# EAGLE schematic Gibbot v4 (EAGLE 5.12)

## Sheet 1 of 7
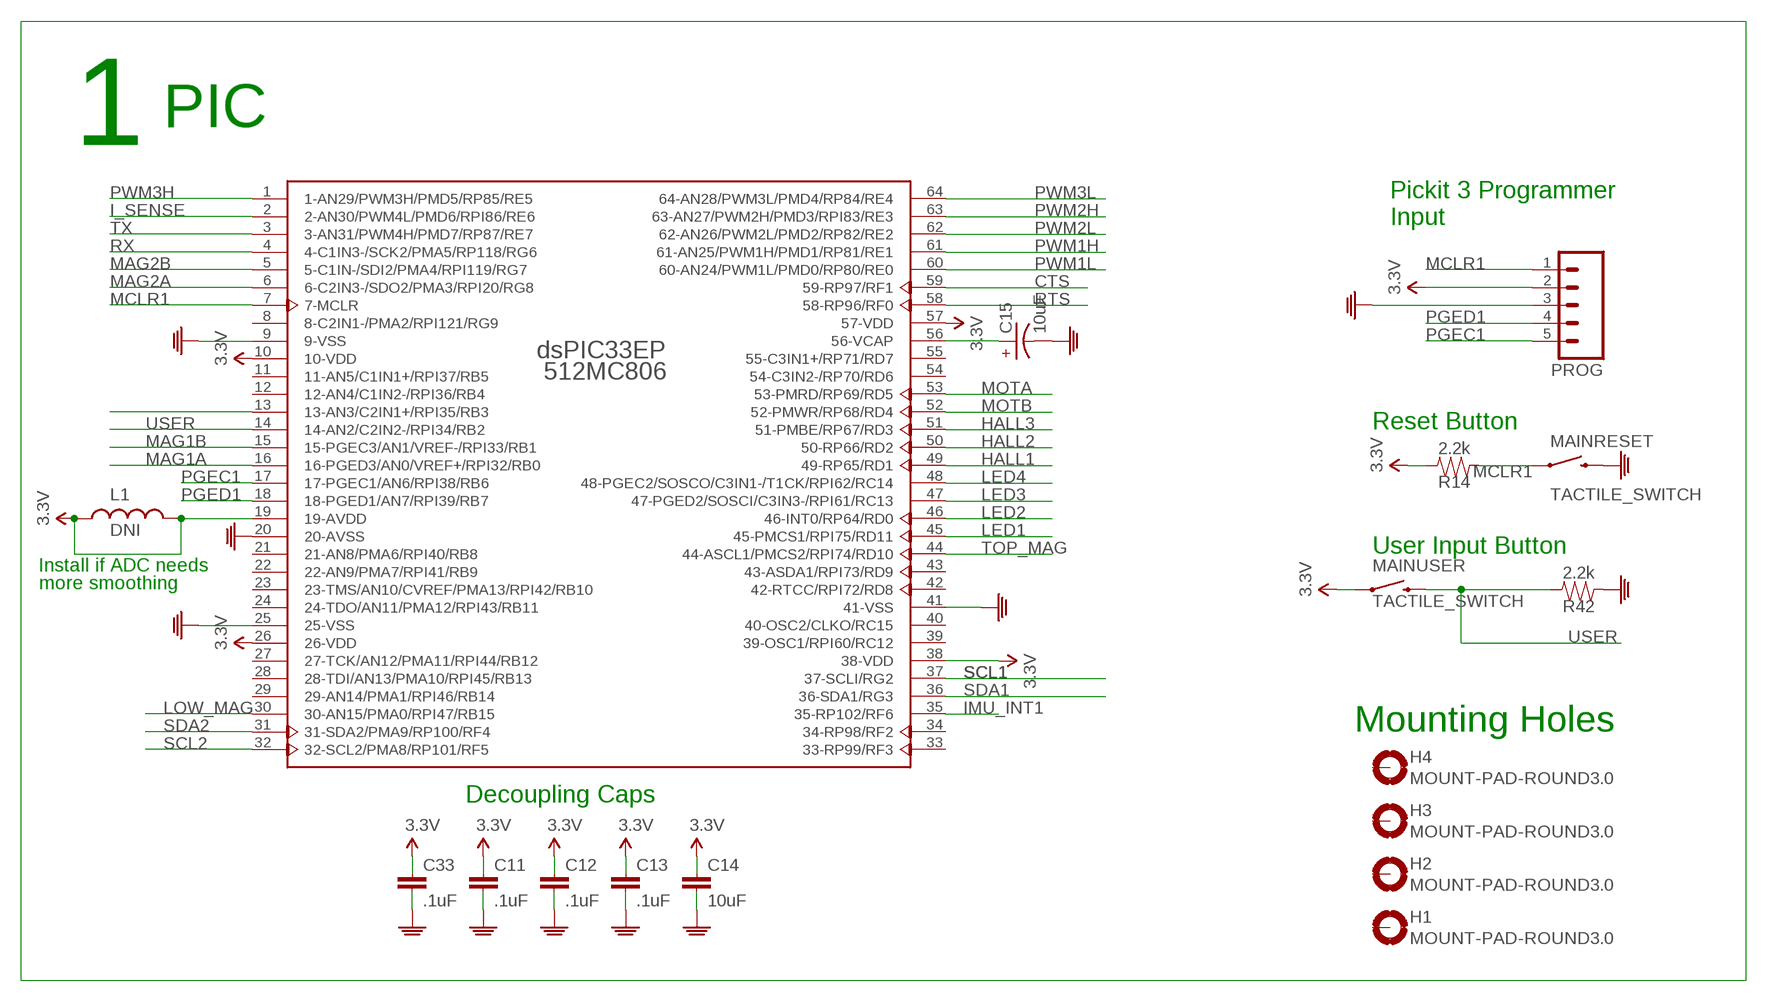
[diagram p0: schematic, sheet 1]

### Parts
C11  .1uF  CAP1206  [1206]
C12  .1uF  CAP1206  [1206]
C13  .1uF  CAP1206  [1206]
C14  10uF  CAP1206  [1206]
C15  10uF  CAP-POLEEH  [EEH-ZA1H101P]
C33  .1uF  CAP1206  [1206]
H1  MOUNT-PAD-ROUND3.0  [3,0-PAD]
H2  MOUNT-PAD-ROUND3.0  [3,0-PAD]
H3  MOUNT-PAD-ROUND3.0  [3,0-PAD]
H4  MOUNT-PAD-ROUND3.0  [3,0-PAD]
L1  DNI  INDUCTOR0603  [0603]
MAINRESET  TACTILE_SWITCH  [TACTILE_SWITCH]
MAINUSER  TACTILE_SWITCH  [TACTILE_SWITCH]
PROG  M05JST-SH  [JST-SH-5]
R14  2.2k  R0603  [0603]
R42  2.2k  R0603  [0603]
U$1  DSPIC33EP512MC806  [TQFP64_10X10]

### Nets
3.3V: C11.1 C12.1 C13.1 C14.1 C33.1 L1.1 L1.2 MAINUSER.1 PROG.2 R14.2 U$1.10(10-VDD) U$1.19(19-AVDD) U$1.26(26-VDD) U$1.38(38-VDD) U$1.57(57-VDD) ; also sheet 2,3,4,6,7
CTS: U$1.59(59-RP97/RF1) ; also sheet 3
GND: C11.2 C12.2 C13.2 C14.2 C15.- C33.2 MAINRESET.2 PROG.3 R42.1 U$1.9(9-VSS) U$1.20(20-AVSS) U$1.25(25-VSS) U$1.41(41-VSS) ; also sheet 2,3,4,5,6,7
HALL1: U$1.49(49-RP65/RD1) ; also sheet 3
HALL2: U$1.50(50-RP66/RD2) ; also sheet 3
HALL3: U$1.51(51-PMBE/RP67/RD3) ; also sheet 3
I_SENSE: U$1.2(2-AN30/PWM4L/PMD6/RPI86/RE6) ; also sheet 2
IMU_INT1: U$1.35(35-RP102/RF6) ; also sheet 3
LED1: U$1.45(45-PMCS1/RPI75/RD11) ; also sheet 3
LED2: U$1.46(46-INT0/RP64/RD0) ; also sheet 3
LED3: U$1.47(47-PGED2/SOSCI/C3IN3-/RPI61/RC13) ; also sheet 3
LED4: U$1.48(48-PGEC2/SOSCO/C3IN1-/T1CK/RPI62/RC14) ; also sheet 3
LOW_MAG: U$1.30(30-AN15/PMA0/RPI47/RB15)
MAG1A: U$1.16(16-PGED3/AN0/VREF+/RPI32/RB0) ; also sheet 3
MAG1B: U$1.15(15-PGEC3/AN1/VREF-/RPI33/RB1) ; also sheet 3
MAG2A: U$1.6(6-C2IN3-/SDO2/PMA3/RPI20/RG8)
MAG2B: U$1.5(5-C1IN-/SDI2/PMA4/RPI119/RG7)
MCLR1: MAINRESET.1 PROG.1 R14.1 U$1.7(7-MCLR)
MOTA: U$1.53(53-PMRD/RP69/RD5)
MOTB: U$1.52(52-PMWR/RP68/RD4)
N$16: C15.+ U$1.56(56-VCAP)
N$34: U$1.13(13-AN3/C2IN1+/RPI35/RB3)
PGEC1: PROG.5 U$1.17(17-PGEC1/AN6/RPI38/RB6)
PGED1: PROG.4 U$1.18(18-PGED1/AN7/RPI39/RB7)
PWM1H: U$1.61(61-AN25/PWM1H/PMD1/RP81/RE1) ; also sheet 2
PWM1L: U$1.60(60-AN24/PWM1L/PMD0/RP80/RE0) ; also sheet 2
PWM2H: U$1.63(63-AN27/PWM2H/PMD3/RPI83/RE3) ; also sheet 2
PWM2L: U$1.62(62-AN26/PWM2L/PMD2/RP82/RE2) ; also sheet 2
PWM3H: U$1.1(1-AN29/PWM3H/PMD5/RP85/RE5) ; also sheet 2
PWM3L: U$1.64(64-AN28/PWM3L/PMD4/RP84/RE4) ; also sheet 2
RTS: U$1.58(58-RP96/RF0) ; also sheet 3
RX: U$1.4(4-C1IN3-/SCK2/PMA5/RP118/RG6) ; also sheet 3
SCL1: U$1.37(37-SCLI/RG2) ; also sheet 3
SCL2: U$1.32(32-SCL2/PMA8/RP101/RF5) ; also sheet 3
SDA1: U$1.36(36-SDA1/RG3) ; also sheet 3
SDA2: U$1.31(31-SDA2/PMA9/RP100/RF4) ; also sheet 3
TOP_MAG: U$1.44(44-ASCL1/PMCS2/RPI74/RD10) ; also sheet 3
TX: U$1.3(3-AN31/PWM4H/PMD7/RP87/RE7) ; also sheet 3
USER: MAINUSER.2 R42.2 U$1.14(14-AN2/C2IN2-/RPI34/RB2)
Unconnected: H1.B3,0(MOUNT) H2.B3,0(MOUNT) H3.B3,0(MOUNT) H4.B3,0(MOUNT) U$1.8(8-C2IN1-/PMA2/RPI121/RG9) U$1.11(11-AN5/C1IN1+/RPI37/RB5) U$1.12(12-AN4/C1IN2-/RPI36/RB4) U$1.21(21-AN8/PMA6/RPI40/RB8) U$1.22(22-AN9/PMA7/RPI41/RB9) U$1.23(23-TMS/AN10/CVREF/PMA13/RPI42/RB10) U$1.24(24-TDO/AN11/PMA12/RPI43/RB11) U$1.27(27-TCK/AN12/PMA11/RPI44/RB12) U$1.28(28-TDI/AN13/PMA10/RPI45/RB13) U$1.29(29-AN14/PMA1/RPI46/RB14) U$1.33(33-RP99/RF3) U$1.34(34-RP98/RF2) U$1.39(39-OSC1/RPI60/RC12) U$1.40(40-OSC2/CLKO/RC15) U$1.42(42-RTCC/RPI72/RD8) U$1.43(43-ASDA1/RPI73/RD9) U$1.54(54-C3IN2-/RP70/RD6) U$1.55(55-C3IN1+/RP71/RD7)

### Notes on the sheet
- PIC
- 1
- Pickit 3 Programmer
- Input
- Reset Button
- User Input Button
- Install if ADC needs
- more smoothing
- Mounting Holes
- Decoupling Caps

## Sheet 2 of 7
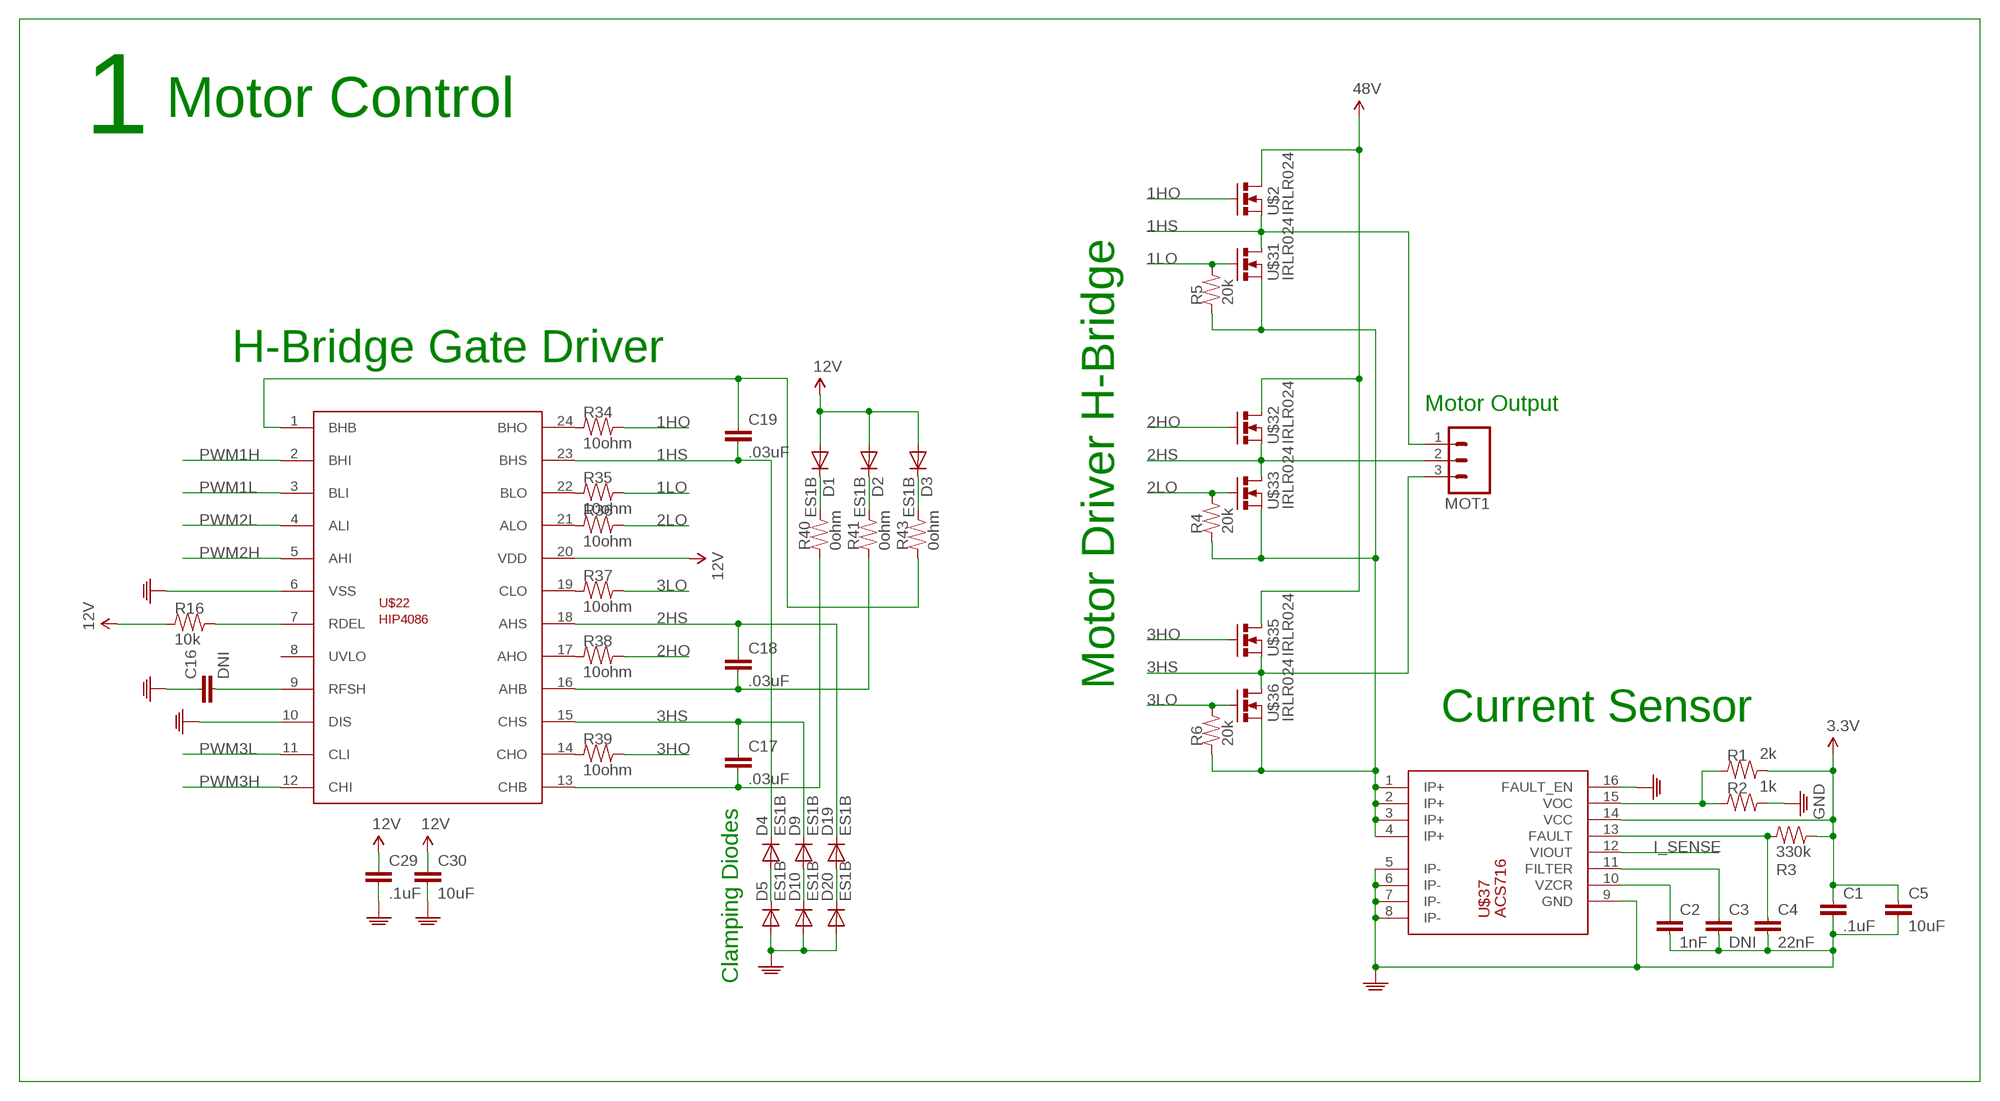
[diagram p1: schematic, sheet 2]

### Parts
C1  .1uF  CAP0603  [0603]
C2  1nF  CAP0603  [0603]
C3  DNI  CAP0603  [0603]
C4  22nF  CAP0603  [0603]
C5  10uF  CAP0603  [0603]
C16  DNI  CAP0603  [0603]
C17  .03uF  CAP0603  [0603]
C18  .03uF  CAP0603  [0603]
C19  .03uF  CAP0603  [0603]
C29  .1uF  CAP0603  [0603]
C30  10uF  CAP0603  [0603]
D1  ES1B  DIODESMA  [SMA-DIODE@1]
D2  ES1B  DIODESMA  [SMA-DIODE@1]
D3  ES1B  DIODESMA  [SMA-DIODE@1]
D4  ES1B  DIODESMA  [SMA-DIODE@1]
D5  ES1B  DIODESMA  [SMA-DIODE@1]
D9  ES1B  DIODESMA  [SMA-DIODE@1]
D10  ES1B  DIODESMA  [SMA-DIODE@1]
D19  ES1B  DIODESMA  [SMA-DIODE@1]
D20  ES1B  DIODESMA  [SMA-DIODE@1]
MOT1  M03MOLEX-MINI-FIT-JR  [39-30-3036]
R1  2k  R0603  [0603]
R2  1k  R0603  [0603]
R3  330k  R0603  [0603]
R4  20k  R0603  [0603]
R5  20k  R0603  [0603]
R6  20k  R0603  [0603]
R16  10k  R0603  [0603]
R34  10ohm  R0603  [0603]
R35  10ohm  R0603  [0603]
R36  10ohm  R0603  [0603]
R37  10ohm  R0603  [0603]
R38  10ohm  R0603  [0603]
R39  10ohm  R0603  [0603]
R40  0ohm  R0603  [0603]
R41  0ohm  R0603  [0603]
R43  0ohm  R0603  [0603]
U$2  IRLR024  N-MOSDPAK  [DPAK]
U$22  HIP4086  [SOIC24-W]
U$31  IRLR024  N-MOSDPAK  [DPAK]
U$32  IRLR024  N-MOSDPAK  [DPAK]
U$33  IRLR024  N-MOSDPAK  [DPAK]
U$35  IRLR024  N-MOSDPAK  [DPAK]
U$36  IRLR024  N-MOSDPAK  [DPAK]
U$37  ACS716  [SOIC16-W]

### Nets
1HO: R34.2 U$2.G
1HS: C19.2 D4.C MOT1.1 U$2.S U$22.23(BHS) U$31.D
1LO: R5.2 R35.2 U$31.G
2HO: R38.2 U$32.G
2HS: C18.1 D19.C MOT1.2 U$22.18(AHS) U$32.S U$33.D
2LO: R4.2 R36.2 U$33.G
3.3V: C1.1 C5.1 R1.2 R3.2 U$37.14(VCC) ; also sheet 1,3,4,6,7
3HO: R39.2 U$35.G
3HS: C17.1 D9.C MOT1.3 U$22.15(CHS) U$35.S U$36.D
3LO: R6.2 R37.2 U$36.G
12V: C29.1 C30.1 D1.A D2.A D3.A R16.1 U$22.20(VDD) ; also sheet 3,4
48V: U$2.D U$32.D U$35.D ; also sheet 4
GND: C1.2 C2.2 C3.2 C4.2 C5.2 C16.1 C29.2 C30.2 D5.A D10.A D20.A R2.2 U$22.6(VSS) U$22.10(DIS) U$37.5(IP-) U$37.6(IP-) U$37.7(IP-) U$37.8(IP-) U$37.9(GND) U$37.16(FAULT_EN) ; also sheet 1,3,4,5,6,7
I_SENSE: U$37.12(VIOUT) ; also sheet 1
N$2: R16.2 U$22.7(RDEL)
N$3: C16.2 U$22.9(RFSH)
N$4: R4.1 R5.1 R6.1 U$31.S U$33.S U$36.S U$37.1(IP+) U$37.2(IP+) U$37.3(IP+) U$37.4(IP+)
N$5: R1.1 R2.1 U$37.15(VOC)
N$6: C4.1 R3.1 U$37.13(FAULT)
N$7: C2.1 U$37.10(VZCR)
N$8: C3.1 U$37.11(FILTER)
N$26: R34.1 U$22.24(BHO)
N$35: R35.1 U$22.22(BLO)
N$36: R36.1 U$22.21(ALO)
N$37: R37.1 U$22.19(CLO)
N$38: R38.1 U$22.17(AHO)
N$48: R39.1 U$22.14(CHO)
N$50: C17.2 R40.1 U$22.13(CHB)
N$52: C18.2 R41.1 U$22.16(AHB)
N$54: C19.1 R43.1 U$22.1(BHB)
N$55: D3.C R43.2
N$58: D2.C R41.2
N$59: D1.C R40.2
N$60: D4.A D5.C
N$61: D9.A D10.C
N$62: D19.A D20.C
PWM1H: U$22.2(BHI) ; also sheet 1
PWM1L: U$22.3(BLI) ; also sheet 1
PWM2H: U$22.5(AHI) ; also sheet 1
PWM2L: U$22.4(ALI) ; also sheet 1
PWM3H: U$22.12(CHI) ; also sheet 1
PWM3L: U$22.11(CLI) ; also sheet 1
Unconnected: U$22.8(UVLO)

### Notes on the sheet
- Motor Control
- 1
- H-Bridge Gate Driver
- Motor Output
- Motor Driver H-Bridge
- Current Sensor
- Clamping Diodes

## Sheet 3 of 7
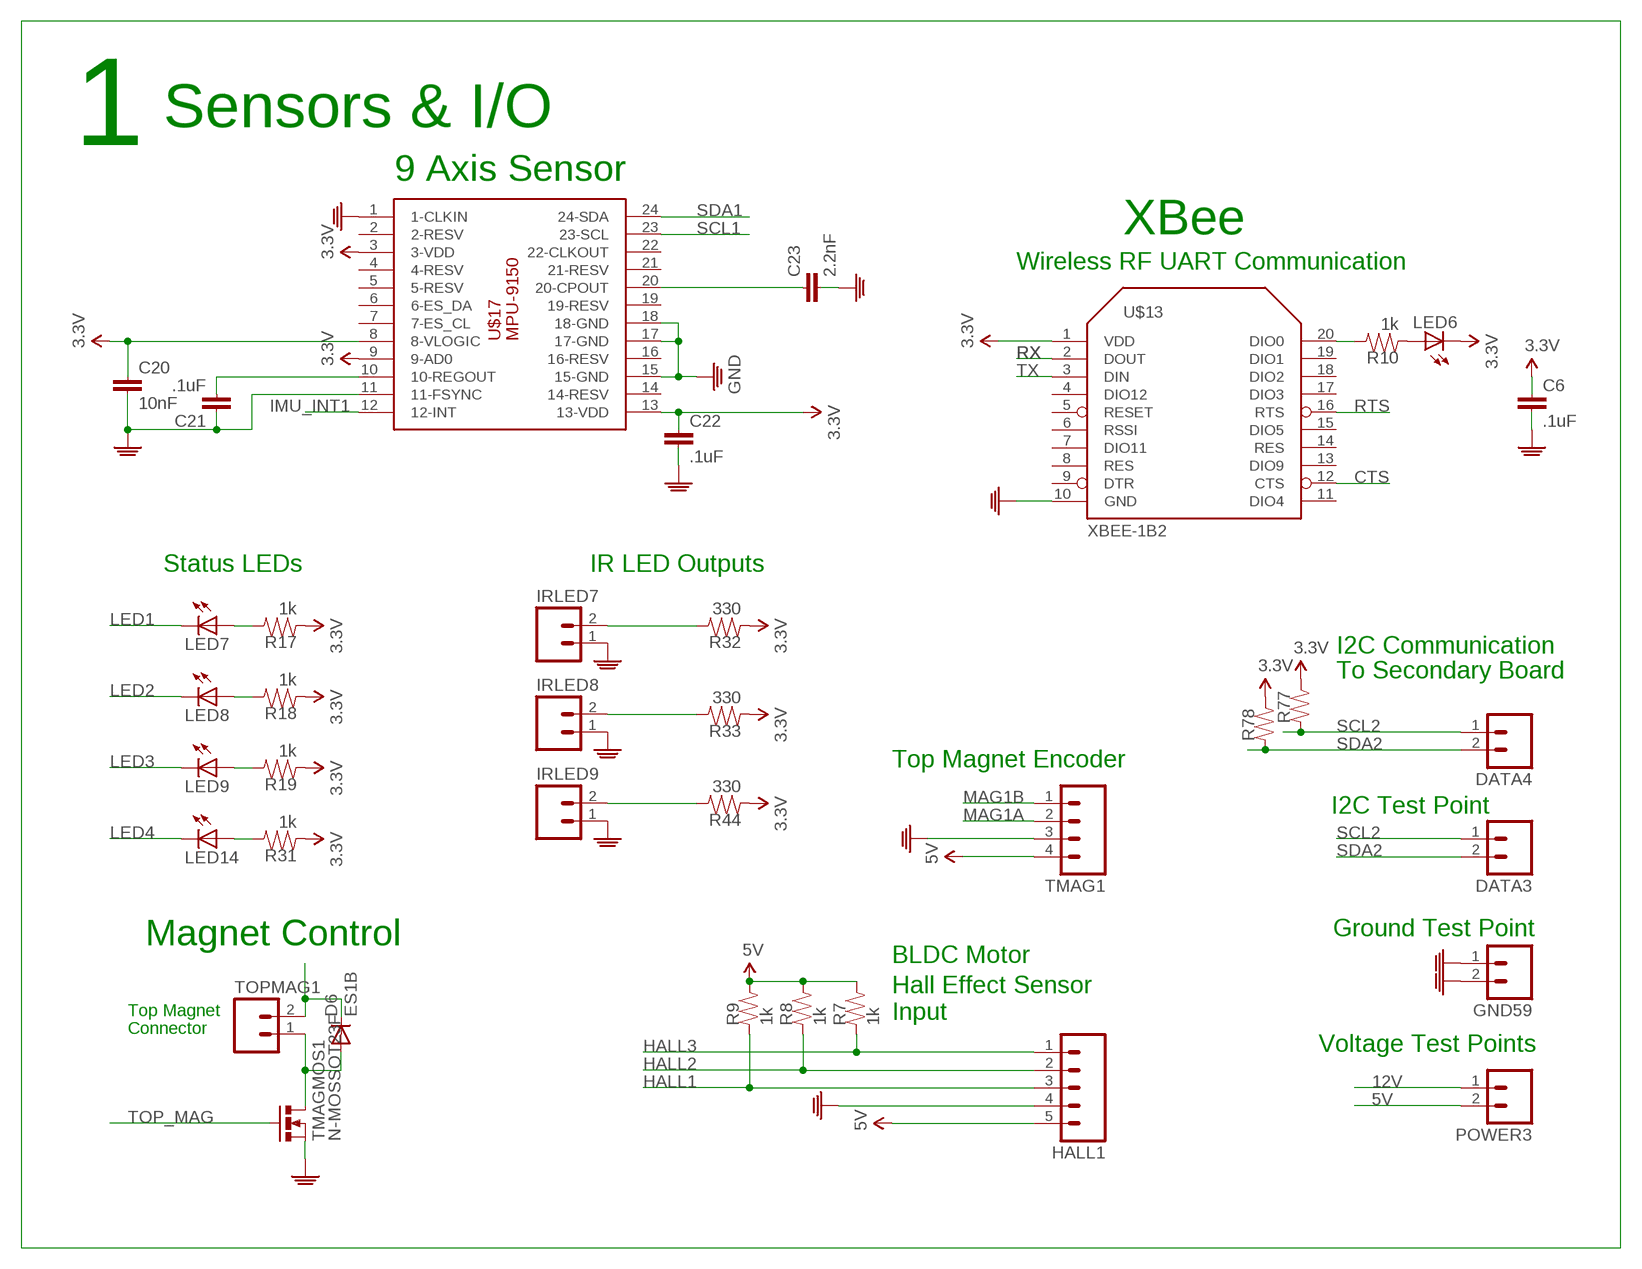
[diagram p2: schematic, sheet 3]

### Parts
C6  .1uF  CAP0603  [0603]
C20  10nF  CAP0603  [0603]
C21  .1uF  CAP0603  [0603]
C22  .1uF  CAP0603  [0603]
C23  2.2nF  CAP0603  [0603]
D6  ES1B  DIODESMA  [SMA-DIODE@1]
DATA3  M02JST-SH  [JST-SH-2]
DATA4  M02JST-SH  [JST-SH-2]
GND59  M02JST-SH  [JST-SH-2]
HALL1  M05JST-SH  [JST-SH-5]
IRLED7  M02JST-SH  [JST-SH-2]
IRLED8  M02JST-SH  [JST-SH-2]
IRLED9  M02JST-SH  [JST-SH-2]
LED6  LED0603  [0603-DIODE]
LED7  LED0603  [0603-DIODE]
LED8  LED0603  [0603-DIODE]
LED9  LED0603  [0603-DIODE]
LED14  LED0603  [0603-DIODE]
POWER3  M02JST-SH  [JST-SH-2]
R7  1k  R0603  [0603]
R8  1k  R0603  [0603]
R9  1k  R0603  [0603]
R10  1k  R0603  [0603]
R17  1k  R0603  [0603]
R18  1k  R0603  [0603]
R19  1k  R0603  [0603]
R31  1k  R0603  [0603]
R32  330  R0603  [0603]
R33  330  R0603  [0603]
R44  330  R0603  [0603]
R77  R0603  [0603]
R78  R0603  [0603]
TMAG1  M04JST-SH  [JST-SH-4]
TMAGMOS1  N-MOSSOT23F  [SOT23F]
TOPMAG1  M02JST-SH  [JST-SH-2]
U$13  XBEE-1B2  [XBEE-SILK]
U$17  MPU-9150  [LGA24_4X4]

### Nets
3.3V: C6.1 C20.1 C22.1 LED6.CAT(C) R17.1 R18.1 R19.1 R31.1 R32.1 R33.1 R44.1 R77.2 R78.2 U$13.1(VDD) U$17.3(3-VDD) U$17.8(8-VLOGIC) U$17.9(9-AD0) U$17.13(13-VDD) ; also sheet 1,2,4,6,7
5V: HALL1.5 POWER3.2 R7.2 R8.2 R9.2 TMAG1.4 ; also sheet 4,7
12V: POWER3.1 ; also sheet 2,4
CTS: U$13.12(CTS) ; also sheet 1
GND: C6.2 C20.2 C21.1 C22.2 C23.2 GND59.1 GND59.2 HALL1.4 IRLED7.1 IRLED8.1 IRLED9.1 TMAG1.3 TMAGMOS1.S U$13.10(GND) U$17.1(1-CLKIN) U$17.11(11-FSYNC) U$17.15(15-GND) U$17.17(17-GND) U$17.18(18-GND) ; also sheet 1,2,4,5,6,7
HALL1: HALL1.3 R9.1 ; also sheet 1
HALL2: HALL1.2 R8.1 ; also sheet 1
HALL3: HALL1.1 R7.1 ; also sheet 1
IMU_INT1: U$17.12(12-INT) ; also sheet 1
LED1: LED7.CAT(C) ; also sheet 1
LED2: LED8.CAT(C) ; also sheet 1
LED3: LED9.CAT(C) ; also sheet 1
LED4: LED14.CAT(C) ; also sheet 1
MAG1A: TMAG1.2 ; also sheet 1
MAG1B: TMAG1.1 ; also sheet 1
N$9: R10.2 U$13.20(DIO0)
N$10: LED6.AN(A) R10.1
N$11: LED7.AN(A) R17.2
N$12: LED8.AN(A) R18.2
N$13: LED9.AN(A) R19.2
N$17: LED14.AN(A) R31.2
N$18: IRLED7.2 R32.2
N$19: IRLED8.2 R33.2
N$20: IRLED9.2 R44.2
N$23: D6.C TOPMAG1.2
N$24: C21.2 U$17.10(10-REGOUT)
N$25: C23.1 U$17.20(20-CPOUT)
N$27: D6.A TMAGMOS1.D TOPMAG1.1
RTS: U$13.16(RTS) ; also sheet 1
RX: U$13.2(DOUT) ; also sheet 1
SCL1: U$17.23(23-SCL) ; also sheet 1
SCL2: DATA3.1 DATA4.1 R77.1 ; also sheet 1
SDA1: U$17.24(24-SDA) ; also sheet 1
SDA2: DATA3.2 DATA4.2 R78.1 ; also sheet 1
TOP_MAG: TMAGMOS1.G ; also sheet 1
TX: U$13.3(DIN) ; also sheet 1
Unconnected: U$13.4(DIO12) U$13.5(RESET) U$13.6(RSSI) U$13.7(DIO11) U$13.8(RES) U$13.9(DTR) U$13.11(DIO4) U$13.13(DIO9) U$13.14(RES) U$13.15(DIO5) U$13.17(DIO3) U$13.18(DIO2) U$13.19(DIO1) U$17.2(2-RESV) U$17.4(4-RESV) U$17.5(5-RESV) U$17.6(6-ES_DA) U$17.7(7-ES_CL) U$17.14(14-RESV) U$17.16(16-RESV) U$17.19(19-RESV) U$17.21(21-RESV) U$17.22(22-CLKOUT)

### Notes on the sheet
- Sensors & I/O
- 1
- 9 Axis Sensor
- XBee
- Wireless RF UART Communication
- Status LEDs | IR LED Outputs
- I2C Communication
- To Secondary Board
- Top Magnet Encoder
- I2C Test Point
- Ground Test Point
- Magnet Control
- BLDC Motor
- Hall Effect Sensor
- Top Magnet | Input
- Connector
- Voltage Test Points

## Sheet 4 of 7
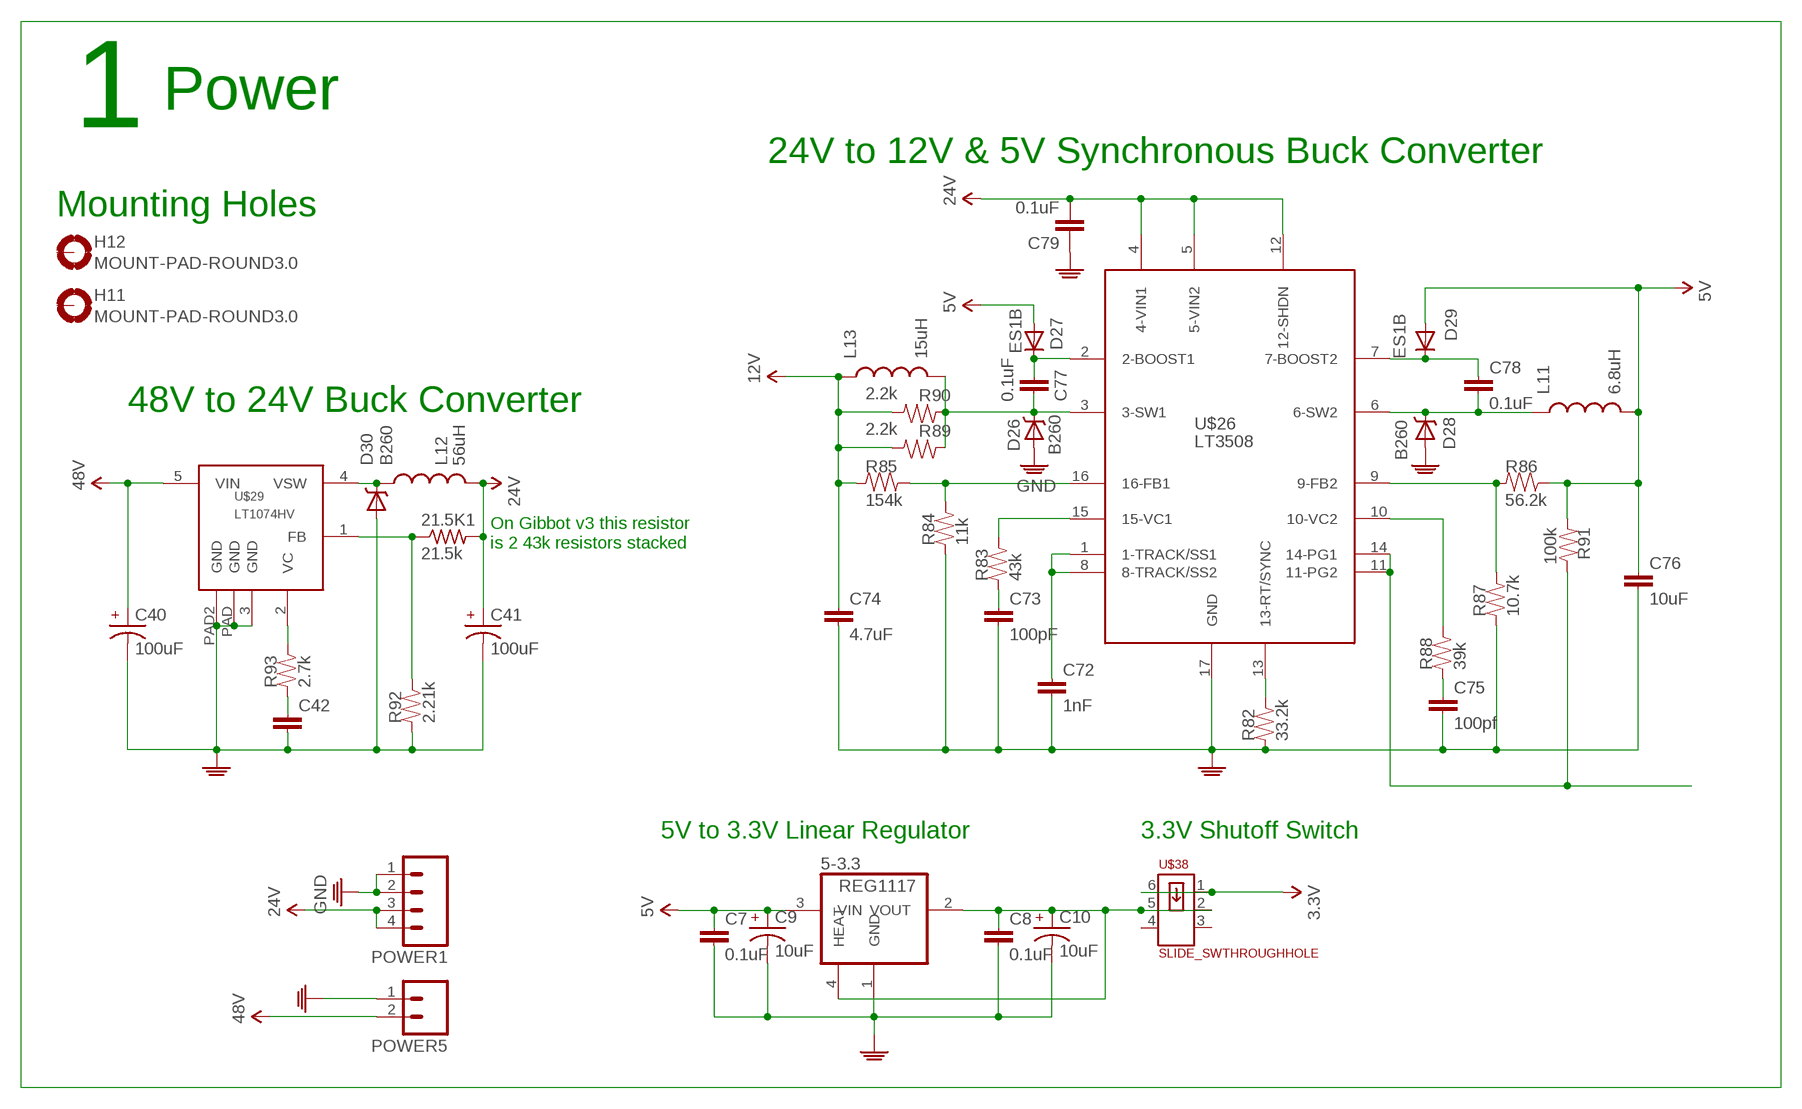
[diagram p3: schematic, sheet 4]

### Parts
5-3.3  REG1117  [SOT223]
21.5K1  21.5k  R-US_R0603  [R0603]
C7  0.1uF  CAP0603  [0603]
C8  0.1uF  CAP0603  [0603]
C9  10uF  CAP-POL0603  [0603-POL]
C10  10uF  CAP-POL0603  [0603-POL]
C40  100uF  CAP-POLEEH  [EEH-ZA1H101P]
C41  100uF  CAP-POLEEH  [EEH-ZA1H101P]
C42  CAP0603  [0603]
C72  1nF  CAP0603  [0603]
C73  100pF  CAP0603  [0603]
C74  4.7uF  CAP0603  [0603]
C75  100pf  CAP0603  [0603]
C76  10uF  CAP0603  [0603]
C77  0.1uF  CAP0603  [0603]
C78  0.1uF  CAP0603  [0603]
C79  0.1uF  CAP0603-CAP  [0603-CAP]
D26  B260  DIODE-SCHOTTKYSMB  [SMB-DIODE]
D27  ES1B  DIODESMA  [SMA-DIODE@1]
D28  B260  DIODE-SCHOTTKYSMB  [SMB-DIODE]
D29  ES1B  DIODESMA  [SMA-DIODE@1]
D30  B260  DIODE-SCHOTTKYSMB  [SMB-DIODE]
H11  MOUNT-PAD-ROUND3.0  [3,0-PAD]
H12  MOUNT-PAD-ROUND3.0  [3,0-PAD]
L11  6.8uH  INDUCTORSRN6045  [SRN6045]
L12  56uH  INDUCTOR2100LL-181  [2100LL-181]
L13  15uH  INDUCTOR2100LL-181  [2100LL-181]
POWER1  M04JST-SH  [JST-SH-4]
POWER5  M02JST-SH  [JST-SH-2]
R82  33.2k  R0603  [0603]
R83  43k  R0603  [0603]
R84  11k  R0603  [0603]
R85  154k  R0603  [0603]
R86  56.2k  R0603  [0603]
R87  10.7k  R0603  [0603]
R88  39k  R0603  [0603]
R89  2.2k  R0603  [0603]
R90  2.2k  R0603  [0603]
R91  100k  R0603  [0603]
R92  2.21k  R0603  [0603]
R93  2.7k  R0603  [0603]
U$26  LT3508  [TSSOP16]
U$29  LT1074HV  [TO220-5]
U$38  SLIDE_SWTHROUGHHOLE  [SLIDE_SWITCH]

### Nets
3.3V: U$38.1 U$38.6 ; also sheet 1,2,3,6,7
5V: 5-3.3.3(VIN) C7.1 C9.+ C76.1 D27.A D29.A L11.P$2 R86.2 R91.1 ; also sheet 3,7
12V: C74.1 L13.1 R85.1 R89.2 R90.2 ; also sheet 2,3
24V: 21.5K1.2 C41.+ C79.2 L12.2 POWER1.3 POWER1.4 U$26.4(4-VIN1) U$26.5(5-VIN2) U$26.12(12-SHDN) ; also sheet 7
48V: C40.+ POWER5.2 U$29.5(VIN) ; also sheet 2
GND: 5-3.3.1(GND) C7.2 C8.2 C9.- C10.- C40.- C41.- C42.2 C72.2 C73.2 C74.2 C75.2 C76.2 C79.1 D26.A D28.A D30.A POWER1.1 POWER1.2 POWER5.1 R82.1 R84.1 R87.1 R92.1 U$26.17(GND) U$29.3(GND) U$29.PAD2(GND) U$29.PAD(GND) ; also sheet 1,2,3,5,6,7
N$42: C42.1 R93.1
N$56: 5-3.3.2(VOUT) 5-3.3.4(HEAT) C8.1 C10.+ U$38.2 U$38.5
N$88: R84.2 R85.2 U$26.16(16-FB1)
N$119: R83.2 U$26.15(15-VC1)
N$129: R82.2 U$26.13(13-RT/SYNC)
N$130: C72.1 U$26.1(1-TRACK/SS1) U$26.8(8-TRACK/SS2)
N$131: C73.1 R83.1
N$134: R86.1 R87.2 U$26.9(9-FB2)
N$135: R91.2 U$26.11(11-PG2) U$26.14(14-PG1)
N$136: C75.1 R88.1
N$137: R88.2 U$26.10(10-VC2)
N$138: C77.2 D26.C L13.2 R89.1 R90.1 U$26.3(3-SW1)
N$139: C77.1 D27.C U$26.2(2-BOOST1)
N$140: C78.2 D28.C L11.P$1 U$26.6(6-SW2)
N$141: C78.1 D29.C U$26.7(7-BOOST2)
N$142: D30.C L12.1 U$29.4(VSW)
N$143: 21.5K1.1 R92.2 U$29.1(FB)
N$144: R93.2 U$29.2(VC)
Unconnected: H11.B3,0(MOUNT) H12.B3,0(MOUNT) U$38.3 U$38.4

### Notes on the sheet
- 1 | Power
- 24V to 12V & 5V Synchronous Buck Converter
- Mounting Holes
- 48V to 24V Buck Converter
- On Gibbot v3 this resistor
- is 2 43k resistors stacked
- 5V to 3.3V Linear Regulator | 3.3V Shutoff Switch

## Sheet 5 of 7
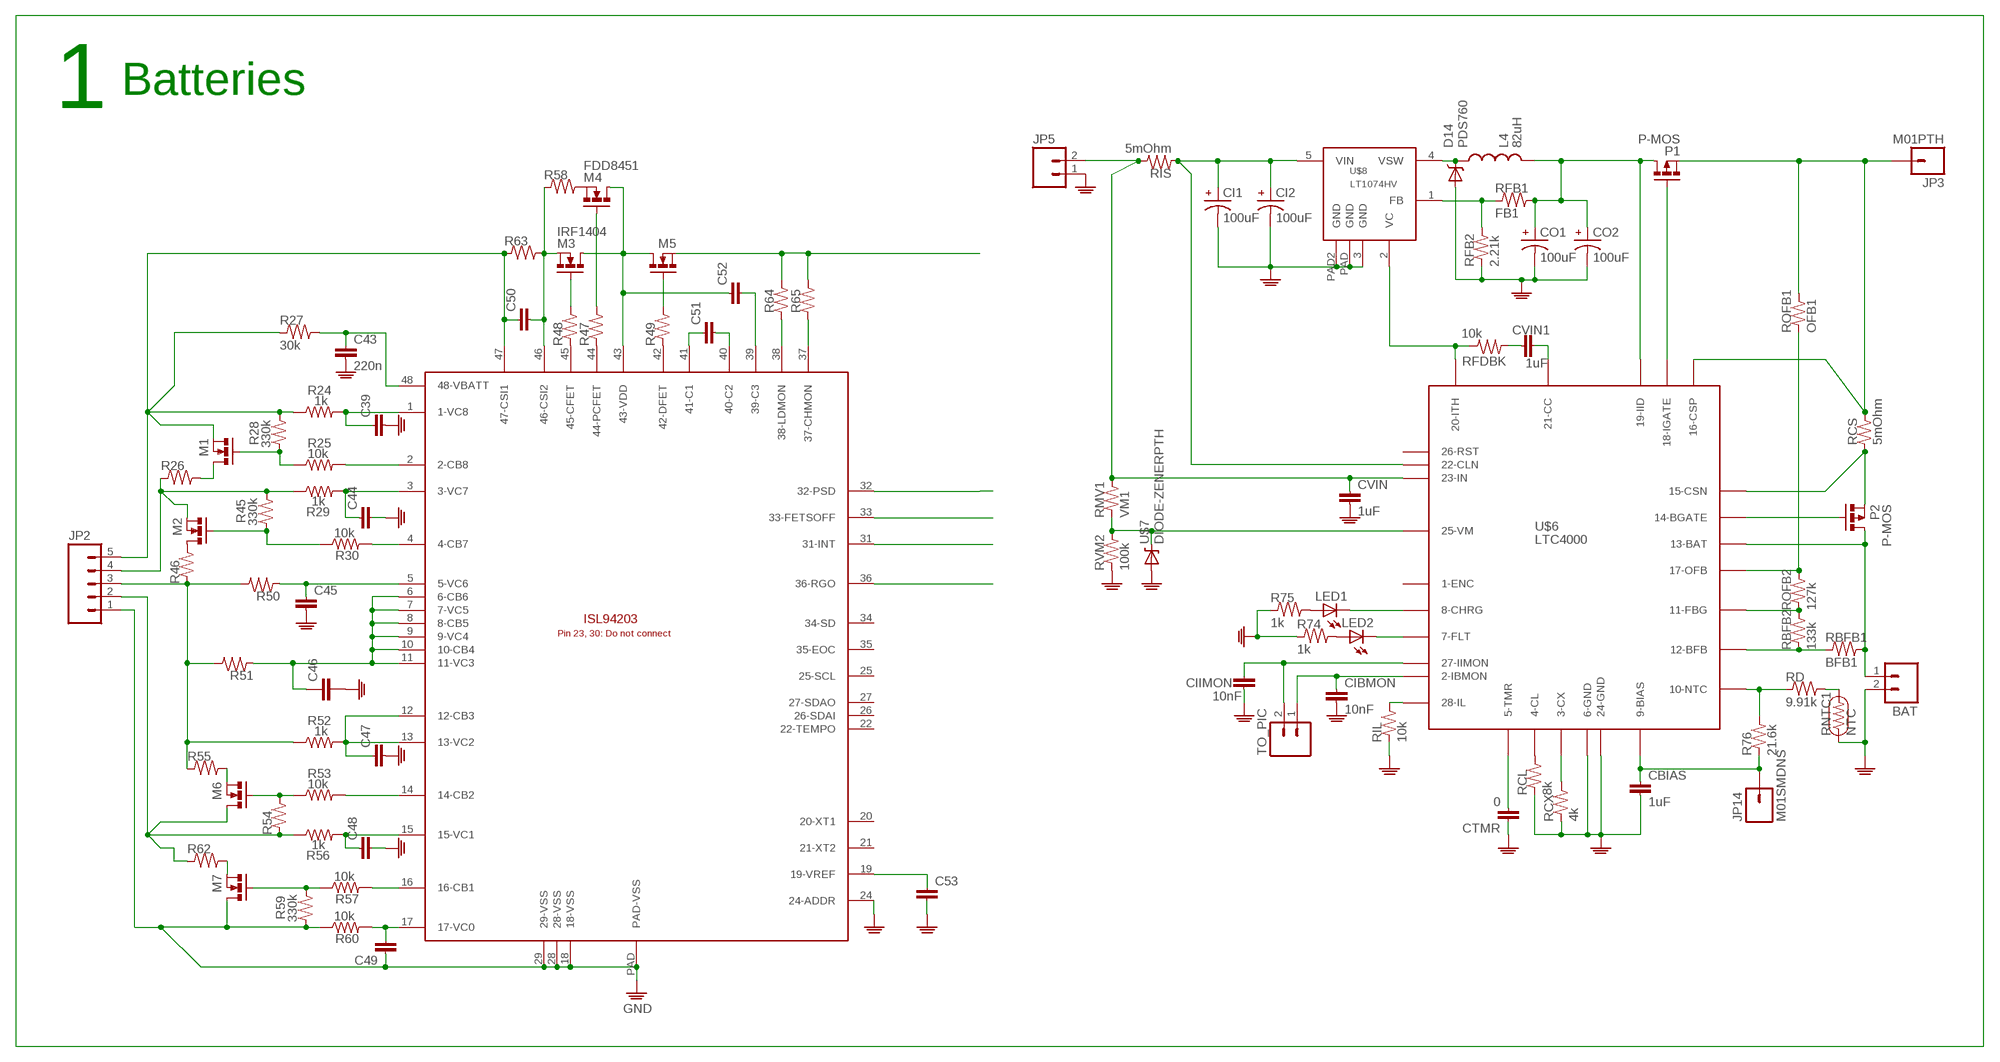
[diagram p4: schematic, sheet 5]

### Parts
BAT  M02LOCK  [1X02_LOCK]
C39  CAP0603  [0603]
C43  220n  CAP0603  [0603]
C44  CAP0603  [0603]
C45  CAP0603  [0603]
C46  CAP0603-CAP  [0603-CAP]
C47  CAP0603  [0603]
C48  CAP0603  [0603]
C49  CAP0603  [0603]
C50  CAP0603  [0603]
C51  CAP0603  [0603]
C52  CAP0603  [0603]
C53  CAP0603  [0603]
CBIAS  1uF  CAPPTH  [CAP-PTH-SMALL]
CI1  100uF  CAP-POLPCV10  [PCV10]
CI2  100uF  CAP-POLPCV10  [PCV10]
CIBMON  10nF  CAPPTH  [CAP-PTH-SMALL]
CIIMON  10nF  CAPPTH  [CAP-PTH-SMALL]
CO1  100uF  CAP-POLPCV10  [PCV10]
CO2  100uF  CAP-POLPCV10  [PCV10]
CTMR  0  CAPPTH  [CAP-PTH-SMALL]
CVIN  1uF  CAPPTH  [CAP-PTH-SMALL]
CVIN1  1uF  CAPPTH  [CAP-PTH-SMALL]
D14  PDS760  DIODE-SCHOTTKYPDS760  [POWERDI5]
JP2  M05PTH_LONGPADS  [1X05_LONGPADS]
JP3  M01PTH  [1X01]
JP5  M02MINI-FIT-JR  [WM8601]
JP14  M01SMDNS  [1X01NS]
L4  82uH  INDUCTOR2200LL-820  [2200LL-820]
LED1  LED0603  [0603-DIODE]
LED2  LED0603  [0603-DIODE]
M1  N-MOSSOT23F  [SOT23F]
M2  N-MOSSOT23F  [SOT23F]
M3  IRF1404  N-MOSD2PAK  [D2PAK@1]
M4  FDD8451  N-MOSDPAK  [DPAK]
M5  N-MOSD2PAK  [D2PAK@1]
M6  N-MOSSOT23F  [SOT23F]
M7  N-MOSSOT23F  [SOT23F]
P1  P-MOS  [D2PAK]
P2  P-MOS  [D2PAK]
R24  1k  R-US_R0603  [R0603]
R25  10k  R-US_R0603  [R0603]
R26  R-SHORT0603  [0603]
R27  30k  R-SHORT0603  [0603]
R28  330k  R-SHORT0603  [0603]
R29  1k  R-US_R0603  [R0603]
R30  10k  R-US_R0603  [R0603]
R45  330k  R-SHORT0603  [0603]
R46  R-SHORT0603  [0603]
R47  R-SHORT0603  [0603]
R48  R-SHORT0603  [0603]
R49  R-SHORT0603  [0603]
R50  R-SHORT0603  [0603]
R51  R-SHORT0603  [0603]
R52  1k  R-US_R0603  [R0603]
R53  10k  R-US_R0603  [R0603]
R54  R-SHORT0603  [0603]
R55  R-SHORT0603  [0603]
R56  1k  R-US_R0603  [R0603]
R57  10k  R-US_R0603  [R0603]
R58  R-SHORT0603  [0603]
R59  330k  R-SHORT0603  [0603]
R60  10k  R-US_R0603  [R0603]
R62  R-SHORT0603  [0603]
R63  R-SHORT0603  [0603]
R64  R0603  [0603]
R65  R0603  [0603]
R74  1k  R-SHORT0603  [0603]
R75  1k  R-SHORT0603  [0603]
R76  21.6k  R-SHORT1206  [1206]
RBFB1  BFB1  R-SHORT1206  [1206]
RBFB2  133k  R-SHORT1206  [1206]
RCL  8k  R-SHORT1206  [1206]
RCS  5mOhm  RPWR4412-B  [PWR4412-B]
RCX  4k  R-SHORT1206  [1206]
RD  9.91k  R-SHORT1206  [1206]
RFB1  FB1  R-SHORT1206  [1206]
RFB2  2.21k  R-SHORT1206  [1206]
RFDBK  10k  R-SHORT1206  [1206]
RIL  10k  R-SHORT1206  [1206]
RIS  5mOhm  RPWR4412-B  [PWR4412-B]
RMV1  VM1  R-SHORT1206  [1206]
RNTC1  NTC  R-NTCPTH  [CAP-PTH-SMALL]
ROFB1  OFB1  R-SHORT1206  [1206]
ROFB2  127k  R-SHORT1206  [1206]
RVM2  100k  R-SHORT1206  [1206]
TO_PIC  M02LOCK  [1X02_LOCK]
U$5  ISL94203  [TQFPNL-48]
U$6  LTC4000  [SSOP28-NARROW]
U$7  DIODE-ZENERPTH  [DIODE-ZENER]
U$8  LT1074HV  [TO220-5]

### Nets
BAT: BAT.1 P2.D RBFB1.2 U$6.P$13(13-BAT)
BFB: RBFB1.1 RBFB2.1 U$6.P$12(12-BFB)
BGATE: P2.G U$6.P$14(14-BGATE)
BIAS: CBIAS.1 JP14.1 R76.1 U$6.P$9(9-BIAS)
BUCKOUT: CO1.+ CO2.+ L4.2 P1.D RFB1.2 U$6.P$19(19-IID)
CHRG: LED1.CAT(C) U$6.P$8(8-CHRG)
CSN: P2.S RCS.P$1 U$6.P$15(15-CSN)
CX: RCX.2 U$6.P$3(3-CX)
FBG: RBFB2.2 ROFB2.1 U$6.P$11(11-FBG)
FLT: LED2.CAT(C) U$6.P$7(7-FLT)
GND: BAT.2 C39.2 C43.2 C44.2 C45.2 C46.2 C47.2 C48.2 C49.1 C53.2 CBIAS.2 CI1.- CI2.- CIBMON.2 CIIMON.2 CO1.- CO2.- CTMR.1 CVIN.2 D14.A JP2.1 JP5.1 M7.D R59.1 R60.1 R74.1 R75.1 RCL.1 RCX.1 RFB2.1 RIL.1 RNTC1.1 RVM2.1 U$5.18(18-VSS) U$5.24(24-ADDR) U$5.28(28-VSS) U$5.29(29-VSS) U$5.PAD(PAD-VSS) U$6.P$6(6-GND) U$6.P$24(24-GND) U$7.P$2(A) U$8.3(GND) U$8.PAD2(GND) U$8.PAD(GND) ; also sheet 1,2,3,4,6,7
IBMON: CIBMON.1 TO_PIC.1 U$6.P$2(2-IBMON)
IGATE: P1.G U$6.P$18(18-IGATE)
IIMON: CIIMON.1 TO_PIC.2 U$6.P$27(27-IIMON)
IL: RIL.2 U$6.P$28(28-IL)
N$43: M1.G R25.1 R28.1
N$64: M1.D R26.2
N$65: R25.2 U$5.2(2-CB8)
N$66: C39.1 R24.2 U$5.1(1-VC8)
N$67: M2.G R30.1 R45.1
N$68: C50.1 JP2.5 M1.S R24.1 R27.1 R28.2 R63.1 U$5.47(47-CSI1)
N$69: C43.1 R27.2 U$5.48(48-VBATT)
N$70: C44.1 R29.2 U$5.3(3-VC7)
N$71: R30.2 U$5.4(4-CB7)
N$72: M6.G R53.1 R54.2
N$73: M2.D R46.2
N$74: R47.1 U$5.44(44-PCFET)
N$75: M3.G R48.2
N$76: M4.G R47.2
N$77: C52.1 M3.D M4.D M5.D U$5.43(43-VDD)
N$78: R49.1 U$5.42(42-DFET)
N$79: M4.S R58.2
N$80: M5.G R49.2
N$81: JP2.3 R46.1 R50.2 R51.2 R52.1 R55.1
N$82: C45.1 R50.1 U$5.5(5-VC6)
N$83: C46.1 R51.1 U$5.6(6-CB6) U$5.7(7-VC5) U$5.8(8-CB5) U$5.9(9-VC4) U$5.10(10-CB4) U$5.11(11-VC3)
N$84: JP2.4 M2.S R26.1 R29.1 R45.2
N$86: C47.1 R52.2 U$5.12(12-CB3) U$5.13(13-VC2)
N$87: R53.2 U$5.14(14-CB2)
N$89: C51.1 U$5.41(41-C1)
N$91: C48.1 R56.2 U$5.15(15-VC1)
N$100: R57.2 U$5.16(16-CB1)
N$101: C49.2 R60.2 U$5.17(17-VC0)
N$102: C50.2 M3.S R58.1 R63.2 U$5.46(46-CSI2)
N$105: M7.S R62.2
N$106: JP2.2 M6.D R54.1 R56.1 R62.1
N$107: M7.G R57.1 R59.2
N$115: M6.S R55.2
N$116: C51.2 U$5.40(40-C2)
N$117: C52.2 U$5.39(39-C3)
N$118: M5.S R64.2 R65.2
N$120: R64.1 U$5.38(38-LDMON)
N$121: R65.1 U$5.37(37-CHMON)
N$122: C53.1 U$5.19(19-VREF)
N$123: R48.1 U$5.45(45-CFET)
N$124: U$5.32(32-PSD)
N$125: U$5.33(33-FETSOFF)
N$126: U$5.31(31-INT)
N$127: U$5.36(36-RGO)
N$132: RCL.2 U$6.P$4(4-CL)
N$133: LED2.AN(A) R74.2
N$145: LED1.AN(A) R75.2
N$146: CVIN.1 JP5.2 RIS.P$2 RMV1.2 U$6.P$23(23-IN)
N$147: D14.C L4.1 U$8.4(VSW)
N$148: RFB1.1 RFB2.2 U$8.1(FB)
N$149: RFDBK.2 U$6.P$20(20-ITH) U$8.2(VC)
N$150: CVIN1.2 U$6.P$21(21-CC)
N$151: CVIN1.1 RFDBK.1
N$152: R76.2 RD.1 U$6.P$10(10-NTC)
N$153: CTMR.2 U$6.P$5(5-TMR)
OFB: ROFB1.1 ROFB2.2 U$6.P$17(17-OFB)
RD: RD.2 RNTC1.2
VIN: CI1.+ CI2.+ RIS.P$1 U$6.P$22(22-CLN) U$8.5(VIN)
VM: RMV1.1 RVM2.2 U$6.P$25(25-VM) U$7.P$1(C)
VOUT: JP3.1 P1.S RCS.P$2 ROFB1.2 U$6.P$16(16-CSP)
Unconnected: U$5.20(20-XT1) U$5.21(21-XT2) U$5.22(22-TEMPO) U$5.25(25-SCL) U$5.26(26-SDAI) U$5.27(27-SDAO) U$5.34(34-SD) U$5.35(35-EOC) U$6.P$1(1-ENC) U$6.P$26(26-RST)

### Notes on the sheet
- 1 | Batteries

## Sheet 6 of 7
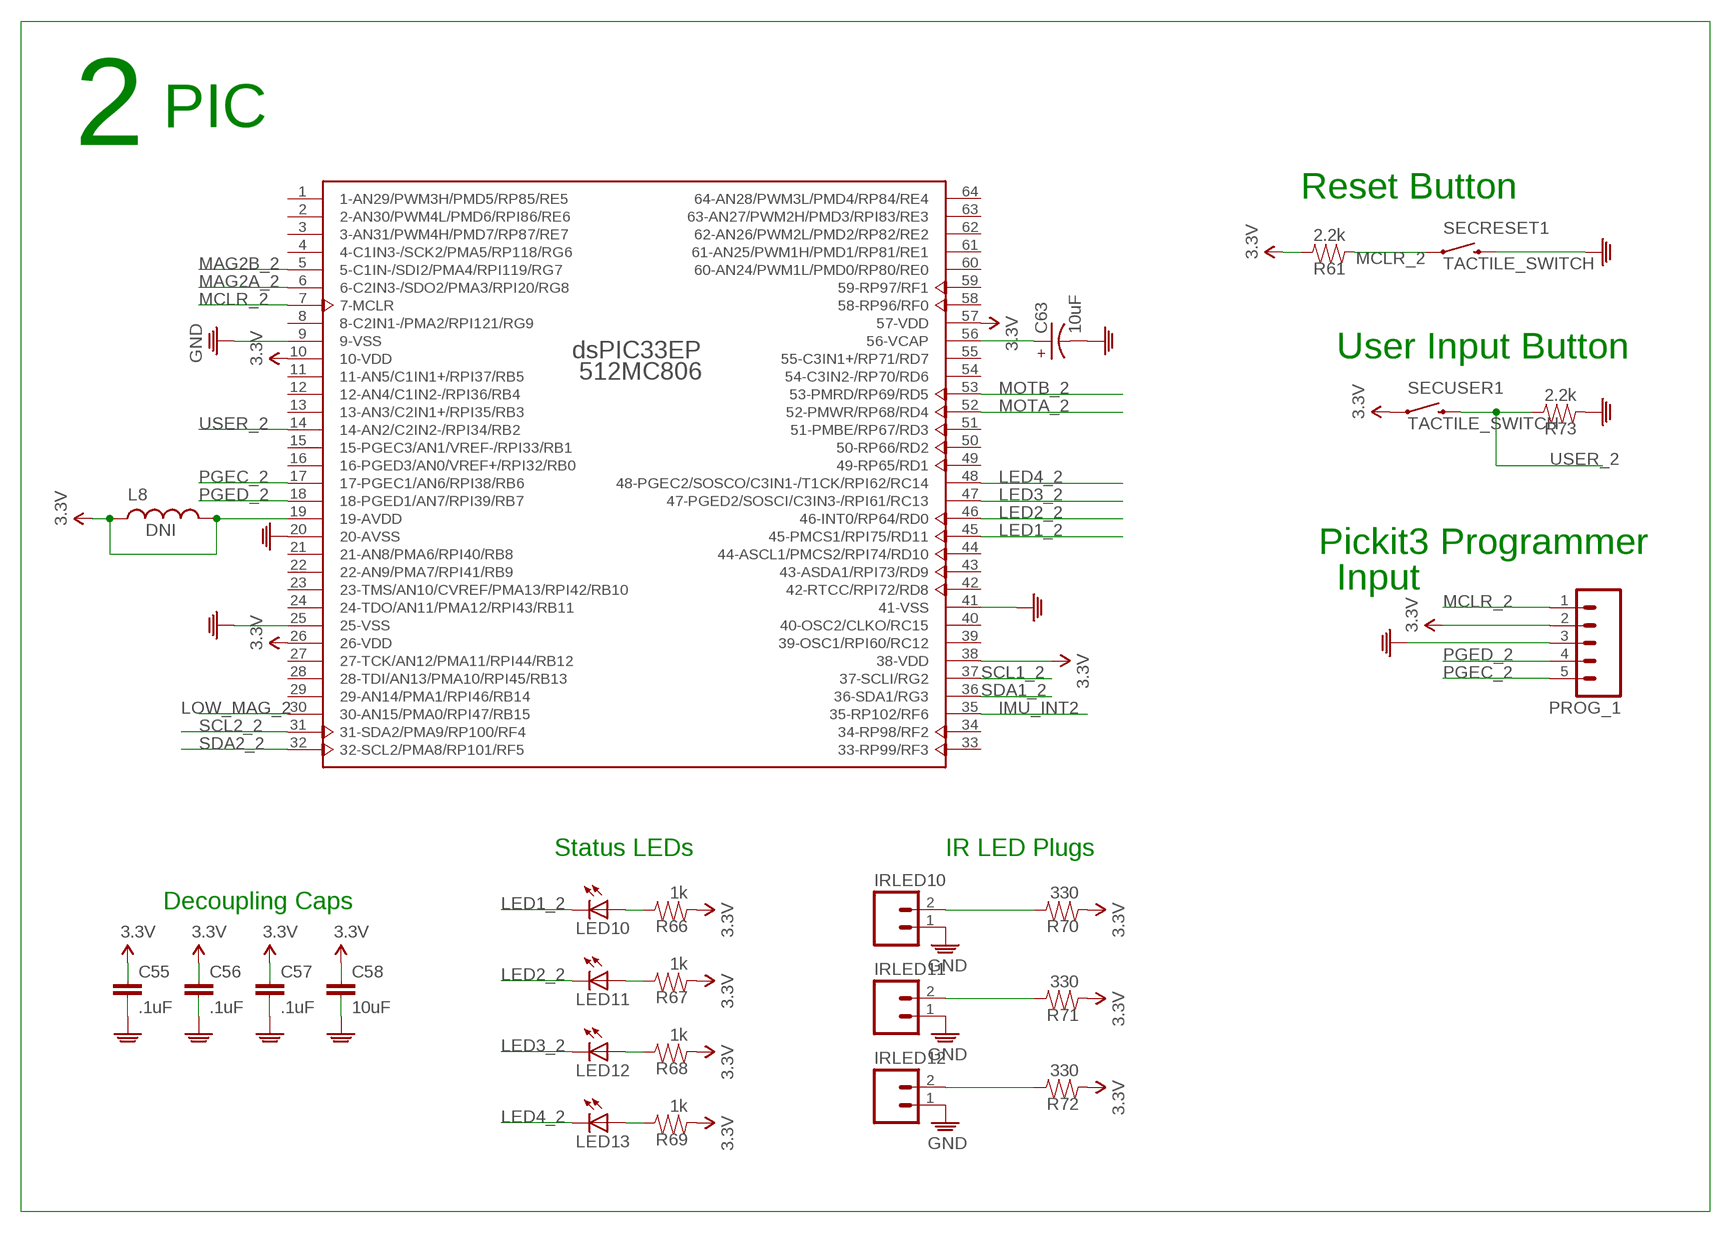
[diagram p5: schematic, sheet 6]

### Parts
C55  .1uF  CAP0603  [0603]
C56  .1uF  CAP0603  [0603]
C57  .1uF  CAP0603  [0603]
C58  10uF  CAP0603  [0603]
C63  10uF  CAP-POL0603  [0603-POL]
IRLED10  M02JST-SH  [JST-SH-2]
IRLED11  M02JST-SH  [JST-SH-2]
IRLED12  M02JST-SH  [JST-SH-2]
L8  DNI  INDUCTOR0603  [0603]
LED10  LED0603  [0603-DIODE]
LED11  LED0603  [0603-DIODE]
LED12  LED0603  [0603-DIODE]
LED13  LED0603  [0603-DIODE]
PROG_1  M05PTH  [1X05]
R61  2.2k  R0603  [0603]
R66  1k  R0603  [0603]
R67  1k  R0603  [0603]
R68  1k  R0603  [0603]
R69  1k  R0603  [0603]
R70  330  R0603  [0603]
R71  330  R0603  [0603]
R72  330  R0603  [0603]
R73  2.2k  R0603  [0603]
SECRESET1  TACTILE_SWITCH  [TACTILE_SWITCH]
SECUSER1  TACTILE_SWITCH  [TACTILE_SWITCH]
U$4  DSPIC33EP512MC806  [TQFP64_10X10]

### Nets
3.3V: C55.1 C56.1 C57.1 C58.1 L8.1 L8.2 PROG_1.2 R61.2 R66.1 R67.1 R68.1 R69.1 R70.1 R71.1 R72.1 SECUSER1.1 U$4.10(10-VDD) U$4.19(19-AVDD) U$4.26(26-VDD) U$4.38(38-VDD) U$4.57(57-VDD) ; also sheet 1,2,3,4,7
GND: C55.2 C56.2 C57.2 C58.2 C63.- IRLED10.1 IRLED11.1 IRLED12.1 PROG_1.3 R73.1 SECRESET1.2 U$4.9(9-VSS) U$4.20(20-AVSS) U$4.25(25-VSS) U$4.41(41-VSS) ; also sheet 1,2,3,4,5,7
IMU_INT2: U$4.35(35-RP102/RF6) ; also sheet 7
LED1_2: LED10.CAT(C) U$4.45(45-PMCS1/RPI75/RD11)
LED2_2: LED11.CAT(C) U$4.46(46-INT0/RP64/RD0)
LED3_2: LED12.CAT(C) U$4.47(47-PGED2/SOSCI/C3IN3-/RPI61/RC13)
LED4_2: LED13.CAT(C) U$4.48(48-PGEC2/SOSCO/C3IN1-/T1CK/RPI62/RC14)
LOW_MAG_2: U$4.30(30-AN15/PMA0/RPI47/RB15) ; also sheet 7
MAG2A_2: U$4.6(6-C2IN3-/SDO2/PMA3/RPI20/RG8) ; also sheet 7
MAG2B_2: U$4.5(5-C1IN-/SDI2/PMA4/RPI119/RG7) ; also sheet 7
MCLR_2: PROG_1.1 R61.1 SECRESET1.1 U$4.7(7-MCLR)
MOTA_2: U$4.52(52-PMWR/RP68/RD4) ; also sheet 7
MOTB_2: U$4.53(53-PMRD/RP69/RD5) ; also sheet 7
N$104: C63.+ U$4.56(56-VCAP)
N$108: LED10.AN(A) R66.2
N$109: LED11.AN(A) R67.2
N$110: LED12.AN(A) R68.2
N$111: LED13.AN(A) R69.2
N$112: IRLED10.2 R70.2
N$113: IRLED11.2 R71.2
N$114: IRLED12.2 R72.2
PGEC_2: PROG_1.5 U$4.17(17-PGEC1/AN6/RPI38/RB6)
PGED_2: PROG_1.4 U$4.18(18-PGED1/AN7/RPI39/RB7)
SCL1_2: U$4.37(37-SCLI/RG2) ; also sheet 7
SCL2_2: U$4.31(31-SDA2/PMA9/RP100/RF4) ; also sheet 7
SDA1_2: U$4.36(36-SDA1/RG3) ; also sheet 7
SDA2_2: U$4.32(32-SCL2/PMA8/RP101/RF5) ; also sheet 7
USER_2: R73.2 SECUSER1.2 U$4.14(14-AN2/C2IN2-/RPI34/RB2)
Unconnected: U$4.1(1-AN29/PWM3H/PMD5/RP85/RE5) U$4.2(2-AN30/PWM4L/PMD6/RPI86/RE6) U$4.3(3-AN31/PWM4H/PMD7/RP87/RE7) U$4.4(4-C1IN3-/SCK2/PMA5/RP118/RG6) U$4.8(8-C2IN1-/PMA2/RPI121/RG9) U$4.11(11-AN5/C1IN1+/RPI37/RB5) U$4.12(12-AN4/C1IN2-/RPI36/RB4) U$4.13(13-AN3/C2IN1+/RPI35/RB3) U$4.15(15-PGEC3/AN1/VREF-/RPI33/RB1) U$4.16(16-PGED3/AN0/VREF+/RPI32/RB0) U$4.21(21-AN8/PMA6/RPI40/RB8) U$4.22(22-AN9/PMA7/RPI41/RB9) U$4.23(23-TMS/AN10/CVREF/PMA13/RPI42/RB10) U$4.24(24-TDO/AN11/PMA12/RPI43/RB11) U$4.27(27-TCK/AN12/PMA11/RPI44/RB12) U$4.28(28-TDI/AN13/PMA10/RPI45/RB13) U$4.29(29-AN14/PMA1/RPI46/RB14) U$4.33(33-RP99/RF3) U$4.34(34-RP98/RF2) U$4.39(39-OSC1/RPI60/RC12) U$4.40(40-OSC2/CLKO/RC15) U$4.42(42-RTCC/RPI72/RD8) U$4.43(43-ASDA1/RPI73/RD9) U$4.44(44-ASCL1/PMCS2/RPI74/RD10) U$4.49(49-RP65/RD1) U$4.50(50-RP66/RD2) U$4.51(51-PMBE/RP67/RD3) U$4.54(54-C3IN2-/RP70/RD6) U$4.55(55-C3IN1+/RP71/RD7) U$4.58(58-RP96/RF0) U$4.59(59-RP97/RF1) U$4.60(60-AN24/PWM1L/PMD0/RP80/RE0) U$4.61(61-AN25/PWM1H/PMD1/RP81/RE1) U$4.62(62-AN26/PWM2L/PMD2/RP82/RE2) U$4.63(63-AN27/PWM2H/PMD3/RPI83/RE3) U$4.64(64-AN28/PWM3L/PMD4/RP84/RE4)

### Notes on the sheet
- 2 | PIC
- Reset Button
- User Input Button
- Pickit3 Programmer
- Input
- Status LEDs | IR LED Plugs
- Decoupling Caps

## Sheet 7 of 7
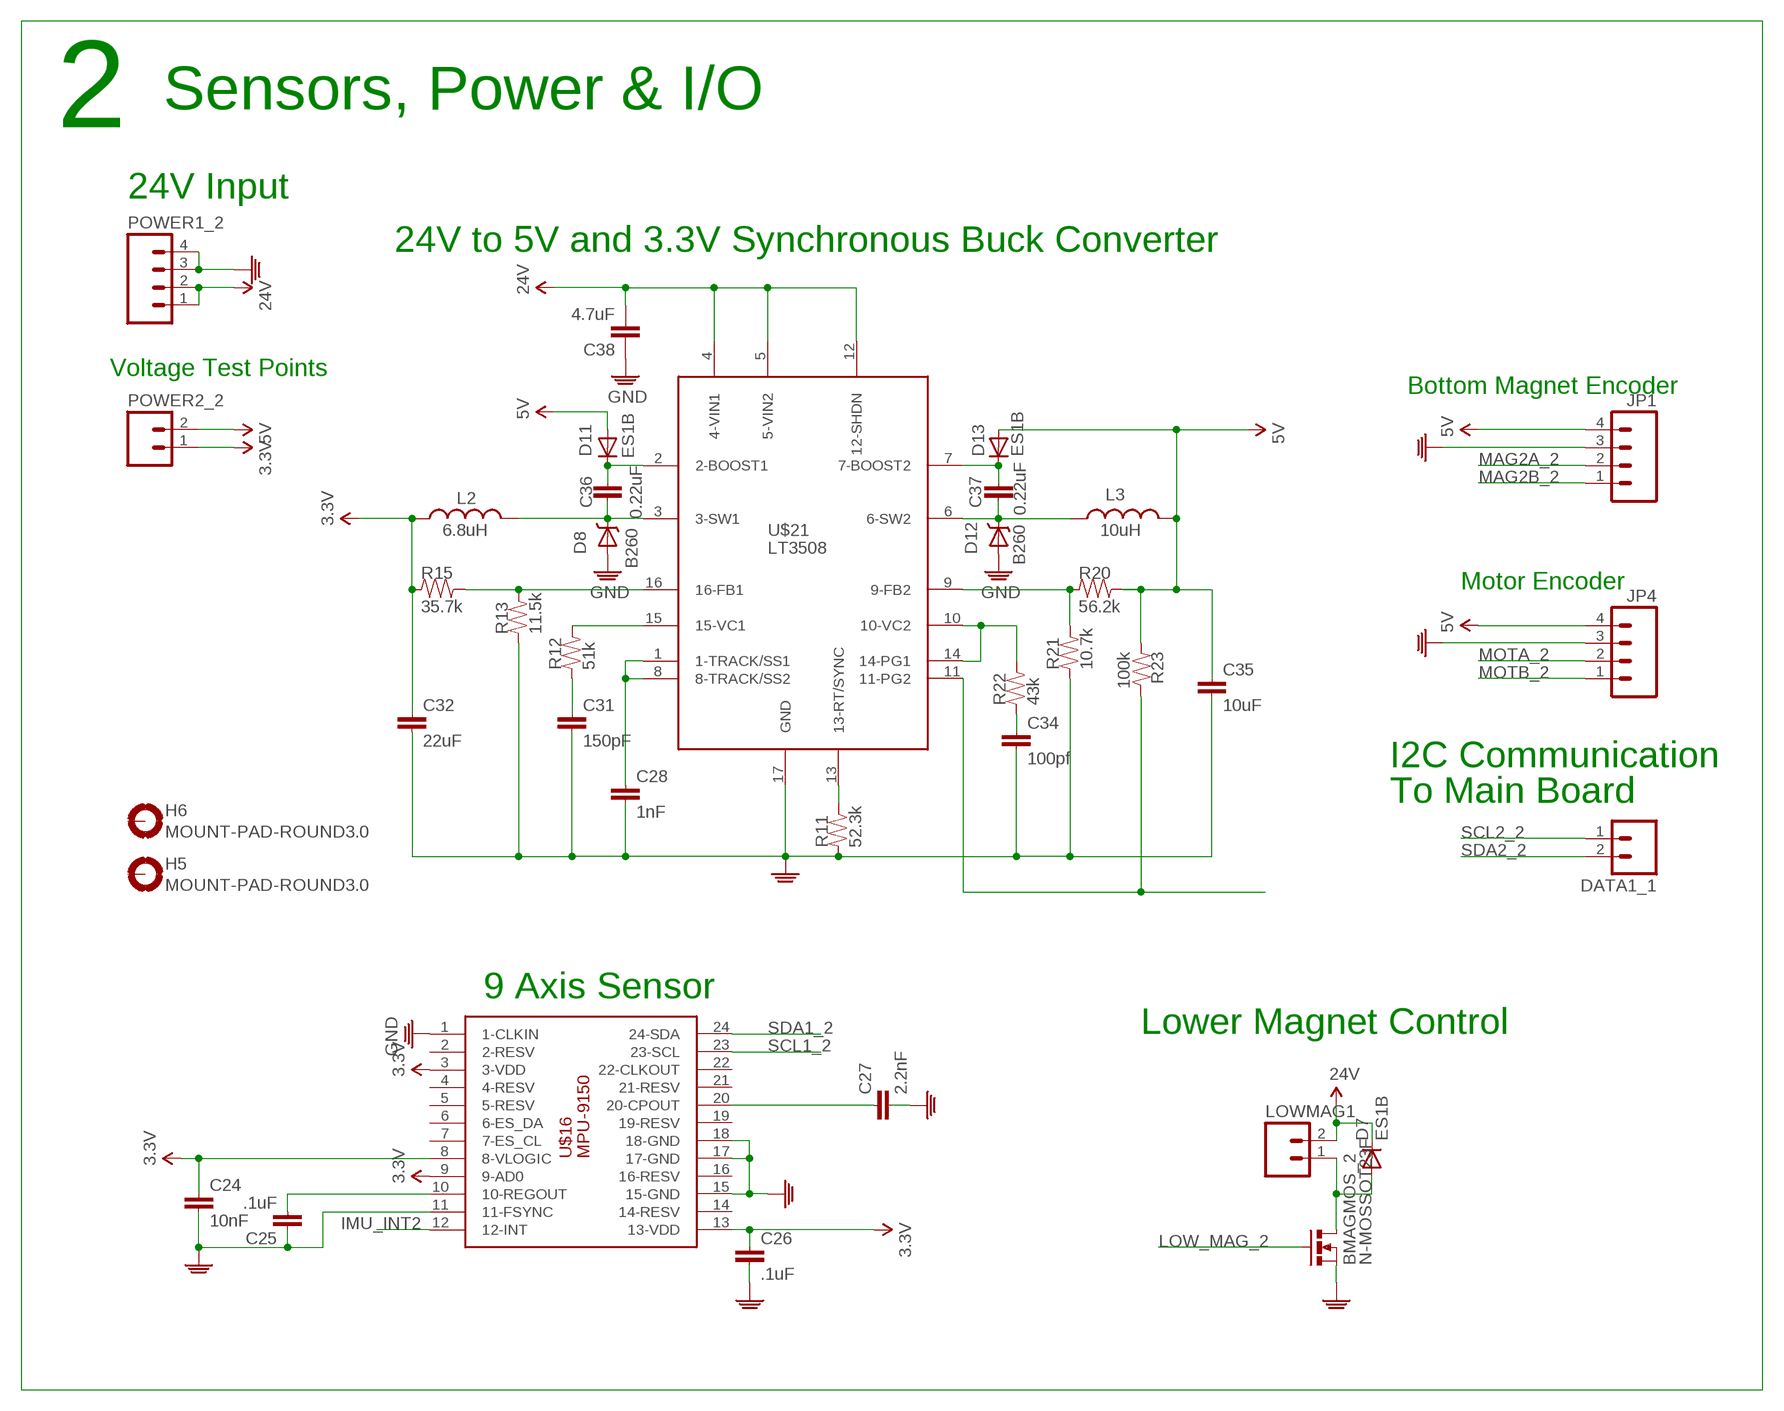
[diagram p6: schematic, sheet 7]

### Parts
BMAGMOS_2  N-MOSSOT23F  [SOT23F]
C24  10nF  CAP0603  [0603]
C25  .1uF  CAP0603  [0603]
C26  .1uF  CAP0603  [0603]
C27  2.2nF  CAP0603  [0603]
C28  1nF  CAP0603  [0603]
C31  150pF  CAP0603  [0603]
C32  22uF  CAP0603  [0603]
C34  100pf  CAP0603  [0603]
C35  10uF  CAP0603  [0603]
C36  0.22uF  CAP0603  [0603]
C37  0.22uF  CAP0603  [0603]
C38  4.7uF  CAP0603-CAP  [0603-CAP]
D7  ES1B  DIODESMA  [SMA-DIODE@1]
D8  B260  DIODE-SCHOTTKYSMB  [SMB-DIODE]
D11  ES1B  DIODESMA  [SMA-DIODE@1]
D12  B260  DIODE-SCHOTTKYSMB  [SMB-DIODE]
D13  ES1B  DIODESMA  [SMA-DIODE@1]
DATA1_1  M02JST-SH  [JST-SH-2]
H5  MOUNT-PAD-ROUND3.0  [3,0-PAD]
H6  MOUNT-PAD-ROUND3.0  [3,0-PAD]
JP1  M04JST-SH  [JST-SH-4]
JP4  M04JST-SH  [JST-SH-4]
L2  6.8uH  INDUCTORSRN6045  [SRN6045]
L3  10uH  INDUCTORSRN6045  [SRN6045]
LOWMAG1  M02JST-SH  [JST-SH-2]
POWER1_2  M04JST-SH  [JST-SH-4]
POWER2_2  M02JST-SH  [JST-SH-2]
R11  52.3k  R0603  [0603]
R12  51k  R0603  [0603]
R13  11.5k  R0603  [0603]
R15  35.7k  R0603  [0603]
R20  56.2k  R0603  [0603]
R21  10.7k  R0603  [0603]
R22  43k  R0603  [0603]
R23  100k  R0603  [0603]
U$3  ISL94203  [TQFPNL-48]  (not placed on a sheet)
U$16  MPU-9150  [LGA24_4X4]
U$21  LT3508  [TSSOP16]

### Nets
3.3V: C24.1 C26.1 C32.1 L2.P$1 POWER2_2.1 R15.1 U$16.3(3-VDD) U$16.8(8-VLOGIC) U$16.9(9-AD0) U$16.13(13-VDD) ; also sheet 1,2,3,4,6
5V: C35.1 D11.A D13.A JP1.4 JP4.4 L3.P$2 POWER2_2.2 R20.2 R23.1 ; also sheet 3,4
24V: C38.2 D7.C LOWMAG1.2 POWER1_2.1 POWER1_2.2 U$21.4(4-VIN1) U$21.5(5-VIN2) U$21.12(12-SHDN) ; also sheet 4
GND: BMAGMOS_2.S C24.2 C25.1 C26.2 C27.2 C28.2 C31.2 C32.2 C34.2 C35.2 C38.1 D8.A D12.A JP1.3 JP4.3 POWER1_2.3 POWER1_2.4 R11.1 R13.1 R21.1 U$16.1(1-CLKIN) U$16.11(11-FSYNC) U$16.15(15-GND) U$16.17(17-GND) U$16.18(18-GND) U$21.17(GND) ; also sheet 1,2,3,4,5,6
IMU_INT2: U$16.12(12-INT) ; also sheet 6
LOW_MAG_2: BMAGMOS_2.G ; also sheet 6
MAG2A_2: JP1.2 ; also sheet 6
MAG2B_2: JP1.1 ; also sheet 6
MOTA_2: JP4.2 ; also sheet 6
MOTB_2: JP4.1 ; also sheet 6
N$21: C25.2 U$16.10(10-REGOUT)
N$22: C27.1 U$16.20(20-CPOUT)
N$29: R11.2 U$21.13(13-RT/SYNC)
N$30: C28.1 U$21.1(1-TRACK/SS1) U$21.8(8-TRACK/SS2)
N$31: C31.1 R12.1
N$32: R12.2 U$21.15(15-VC1)
N$39: R13.2 R15.2 U$21.16(16-FB1)
N$40: R20.1 R21.2 U$21.9(9-FB2)
N$44: R23.2 U$21.11(11-PG2)
N$45: C34.1 R22.1
N$46: R22.2 U$21.10(10-VC2) U$21.14(14-PG1)
N$47: C36.2 D8.C L2.P$2 U$21.3(3-SW1)
N$49: C36.1 D11.C U$21.2(2-BOOST1)
N$51: C37.2 D12.C L3.P$1 U$21.6(6-SW2)
N$53: C37.1 D13.C U$21.7(7-BOOST2)
N$63: BMAGMOS_2.D D7.A LOWMAG1.1
SCL1_2: U$16.23(23-SCL) ; also sheet 6
SCL2_2: DATA1_1.1 ; also sheet 6
SDA1_2: U$16.24(24-SDA) ; also sheet 6
SDA2_2: DATA1_1.2 ; also sheet 6
Unconnected: H5.B3,0(MOUNT) H6.B3,0(MOUNT) U$3.1(1-VC8) U$3.2(2-CB8) U$3.3(3-VC7) U$3.4(4-CB7) U$3.5(5-VC6) U$3.6(6-CB6) U$3.7(7-VC5) U$3.8(8-CB5) U$3.9(9-VC4) U$3.10(10-CB4) U$3.11(11-VC3) U$3.12(12-CB3) U$3.13(13-VC2) U$3.14(14-CB2) U$3.15(15-VC1) U$3.16(16-CB1) U$3.17(17-VC0) U$3.18(18-VSS) U$3.19(19-VREF) U$3.20(20-XT1) U$3.21(21-XT2) U$3.22(22-TEMPO) U$3.24(24-ADDR) U$3.25(25-SCL) U$3.26(26-SDAI) U$3.27(27-SDAO) U$3.28(28-VSS) U$3.29(29-VSS) U$3.31(31-INT) U$3.32(32-PSD) U$3.33(33-FETSOFF) U$3.34(34-SD) U$3.35(35-EOC) U$3.36(36-RGO) U$3.37(37-CHMON) U$3.38(38-LDMON) U$3.39(39-C3) U$3.40(40-C2) U$3.41(41-C1) U$3.42(42-DFET) U$3.43(43-VDD) U$3.44(44-PCFET) U$3.45(45-CFET) U$3.46(46-CSI2) U$3.47(47-CSI1) U$3.48(48-VBATT) U$3.PAD(PAD-VSS) U$16.2(2-RESV) U$16.4(4-RESV) U$16.5(5-RESV) U$16.6(6-ES_DA) U$16.7(7-ES_CL) U$16.14(14-RESV) U$16.16(16-RESV) U$16.19(19-RESV) U$16.21(21-RESV) U$16.22(22-CLKOUT)

### Notes on the sheet
- 2 | Sensors, Power & I/O
- 24V Input
- 24V to 5V and 3.3V Synchronous Buck Converter
- Voltage Test Points
- Bottom Magnet Encoder
- Motor Encoder
- I2C Communication
- To Main Board
- 9 Axis Sensor
- Lower Magnet Control

## Library data of the parts
5-3.3 = Gibbot v4:REG1117: 800mA and 1A Low Dropout (LDO) Positive Regulator 1.8V, 2.5V, 2.85V, 3.3V, 5V, and Adj
21.5K1 R24 R25 R29 R30 R52 R53 R56 R57 R60 = Gibbot:R-US_: RESISTOR, American symbol
BAT DATA1_1 DATA3 DATA4 GND59 IRLED7-IRLED12 JP5 LOWMAG1 POWER2_2 POWER3 POWER5 TO_PIC TOPMAG1 = Gibbot v4:M02: Header 2 Standard 2-pin 0.1" header. Use with straight break away headers (SKU : PRT-00116), right angle break away headers (PRT-00553), swiss pins (PRT-00743), machine pins (PRT-00117), and female headers (PRT-00115). Molex polarized connector foot print use with SKU : PRT-08233 with associated crimp pins and housings.
BMAGMOS_2 M1-M7 TMAGMOS1 U$2 U$31-U$33 U$35 U$36 = Gibbot v4:N-MOS
C1-C8 C11-C14 C16-C37 C39 C42-C45 C47-C53 C55-C58 C72-C78 CBIAS CIBMON CIIMON CTMR CVIN CVIN1 = Gibbot v4:CAP: Capacitor Standard 0603 ceramic capacitor, and 0.1" leaded capacitor.
C9 C10 C15 C40 C41 C63 CI1 CI2 CO1 CO2 = Gibbot v4:CAP-POL: CAPACITOR, American symbol
C38 C46 C79 = Gibbot:CAP: Capacitor Standard 0603 ceramic capacitor, and 0.1" leaded capacitor.
D1-D7 D9-D11 D13 D19 D20 D27 D29 = Gibbot v4:DIODE: Diode These are standard reverse protection diodes and small signal diodes. SMA package can handle up to about 1A. SOD-323 can handle about 200mA. What the SOD-323 package when ordering, there are some mfgs out there that are 5-pin packages.
D8 D12 D14 D26 D28 D30 = Gibbot v4:DIODE-SCHOTTKY
H1-H6 H11 H12 = Gibbot v4:MOUNT-PAD-ROUND: MOUNTING PAD, round
HALL1 PROG PROG_1 = Gibbot v4:M05: Header 5 Standard 5-pin 0.1" header. Use with straight break away headers (SKU : PRT-00116), right angle break away headers (PRT-00553), swiss pins (PRT-00743), machine pins (PRT-00117), and female headers (PRT-00115). Molex polarized connector foot print use with SKU : PRT-08230 with associated crimp pins and housings.
JP1 JP4 POWER1 POWER1_2 TMAG1 = Gibbot v4:M04: Header 4 Standard 4-pin 0.1" header. Use with straight break away headers (SKU : PRT-00116), right angle break away headers (PRT-00553), swiss pins (PRT-00743), machine pins (PRT-00117), and female headers (PRT-00115). Molex polarized connector foot print use with SKU : PRT-08231 with associated crimp pins and housings. 1MM SMD Version SKU: PRT-10208
JP2 = Gibbot:M05: Header 5 Standard 5-pin 0.1" header. Use with straight break away headers (SKU : PRT-00116), right angle break away headers (PRT-00553), swiss pins (PRT-00743), machine pins (PRT-00117), and female headers (PRT-00115). Molex polarized connector foot print use with SKU : PRT-08230 with associated crimp pins and housings.
JP3 JP14 = Gibbot v4:M01: Header 1 Standard 1-pin 0.1" header. Use with straight break away headers (SKU : PRT-00116), right angle break away headers (PRT-00553), swiss pins (PRT-00743), machine pins (PRT-00117), and female headers (PRT-00115).
L1-L4 L8 L11 L12 = Gibbot v4:INDUCTOR: Inductors Basic Inductor/Choke - 0603 and 1206. Footprints are not proven and vary greatly between part numbers.
L13 = Gibbot:INDUCTOR: Inductors Basic Inductor/Choke - 0603 and 1206. Footprints are not proven and vary greatly between part numbers.
LED1 LED2 LED6-LED14 = Gibbot v4:LED: LEDs Standard schematic elements and footprints for 5mm, 3mm, 1206, and 0603 sized LEDs. 5mm - Spark Fun Electronics SKU : COM-00529 (and others)
MAINRESET MAINUSER SECRESET1 SECUSER1 = Gibbot v4:TACTILE_SWITCH
MOT1 = Gibbot v4:M03: Header 3 Standard 3-pin 0.1" header. Use with straight break away headers (SKU : PRT-00116), right angle break away headers (PRT-00553), swiss pins (PRT-00743), machine pins (PRT-00117), and female headers (PRT-00115). Molex polarized connector foot print use with SKU : PRT-08232 with associated crimp pins and housings.
P1 P2 = Gibbot v4:P-MOS
R1-R23 R31-R44 R61 R64-R73 R77 R78 R82-R93 RCS RIS = Gibbot v4:R: RESISTOR, American symbol
R26-R28 R45-R51 R54 R55 R58 R59 R62 R63 R74-R76 RBFB1 RBFB2 RCL RCX RD RFB1 RFB2 RFDBK RIL RMV1 ROFB1 ROFB2 RVM2 = Gibbot v4:R-SHORT
RNTC1 = Gibbot v4:R-NTC
U$1 U$4 = Gibbot v4:DSPIC33EP512MC806
U$3 = Gibbot:ISL94203
U$5 = Gibbot v4:ISL94203
U$6 = Gibbot v4:LTC4000
U$7 = Gibbot v4:DIODE-ZENER: Zener Diode Production Part - 8199 3.4V Zener Voltage
U$8 U$29 = Gibbot v4:LT1074HV
U$13 = Gibbot v4:XBEE-1
U$16 U$17 = Gibbot v4:MPU-9150
U$21 U$26 = Gibbot v4:LT3508
U$22 = Gibbot v4:HIP4086
U$37 = Gibbot v4:ACS716
U$38 = Gibbot v4:SLIDE_SW